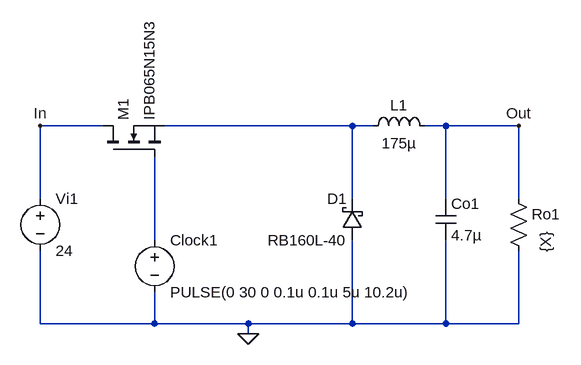
[diagram p0: schematic Draft1.asc]
Draft1.asc, the LTspice schematic file:
Version 4.1
SHEET 1 880 680
WIRE -96 64 -192 64
WIRE 288 64 0 64
WIRE 320 64 288 64
WIRE 432 64 400 64
WIRE 544 64 432 64
WIRE -192 176 -192 64
WIRE 288 176 288 64
WIRE 432 176 432 64
WIRE 544 176 544 64
WIRE -16 240 -16 112
WIRE -192 368 -192 256
WIRE -16 368 -16 320
WIRE -16 368 -192 368
WIRE 128 368 -16 368
WIRE 288 368 288 240
WIRE 288 368 128 368
WIRE 432 368 432 240
WIRE 432 368 288 368
WIRE 544 368 544 256
WIRE 544 368 432 368
WIRE 128 384 128 368
FLAG 128 384 0
FLAG 544 64 Out
FLAG -192 64 In
SYMBOL nmos -96 112 R270
SYMATTR InstName M1
SYMATTR Value IPB065N15N3
SYMBOL ind 304 80 R270
WINDOW 0 32 56 VTop 2
WINDOW 3 5 56 VBottom 2
SYMATTR InstName L1
SYMATTR Value 175µ
SYMBOL schottky 304 240 R180
WINDOW 0 24 64 Left 2
WINDOW 3 24 0 Left 2
SYMATTR InstName D1
SYMATTR Value RB160L-40
SYMATTR Description Diode
SYMATTR Type diode
SYMBOL cap 416 176 R0
SYMATTR InstName Co1
SYMATTR Value 4.7µ
SYMBOL res 528 160 R0
WINDOW 3 58 99 VLeft 2
SYMATTR Value {X}
SYMATTR InstName Ro1
SYMBOL voltage -16 224 R0
WINDOW 123 0 0 Left 2
WINDOW 39 0 0 Left 2
SYMATTR InstName Clock1
SYMATTR Value PULSE(0 30 0 0.1u 0.1u 5u 10.2u)
SYMBOL voltage -192 160 R0
WINDOW 123 0 0 Left 2
WINDOW 39 0 0 Left 2
SYMATTR InstName Vi1
SYMATTR Value 24

The netlist it stands for:
* Draft1.asc
M1 In N002 N001 N001 IPB065N15N3
L1 N001 Out 175µ
D1 0 N001 RB160L-40
Co1 Out 0 4.7µ
Ro1 Out 0 {X}
V§Clock1 N002 0 PULSE(0 30 0 0.1u 0.1u 5u 10.2u)
Vi1 In 0 24
.model D D
.lib standard.dio
.model NMOS NMOS
.model PMOS PMOS
.lib standard.mos
.backanno
.end